# EAGLE design Schematics (EAGLE 9.0.0)
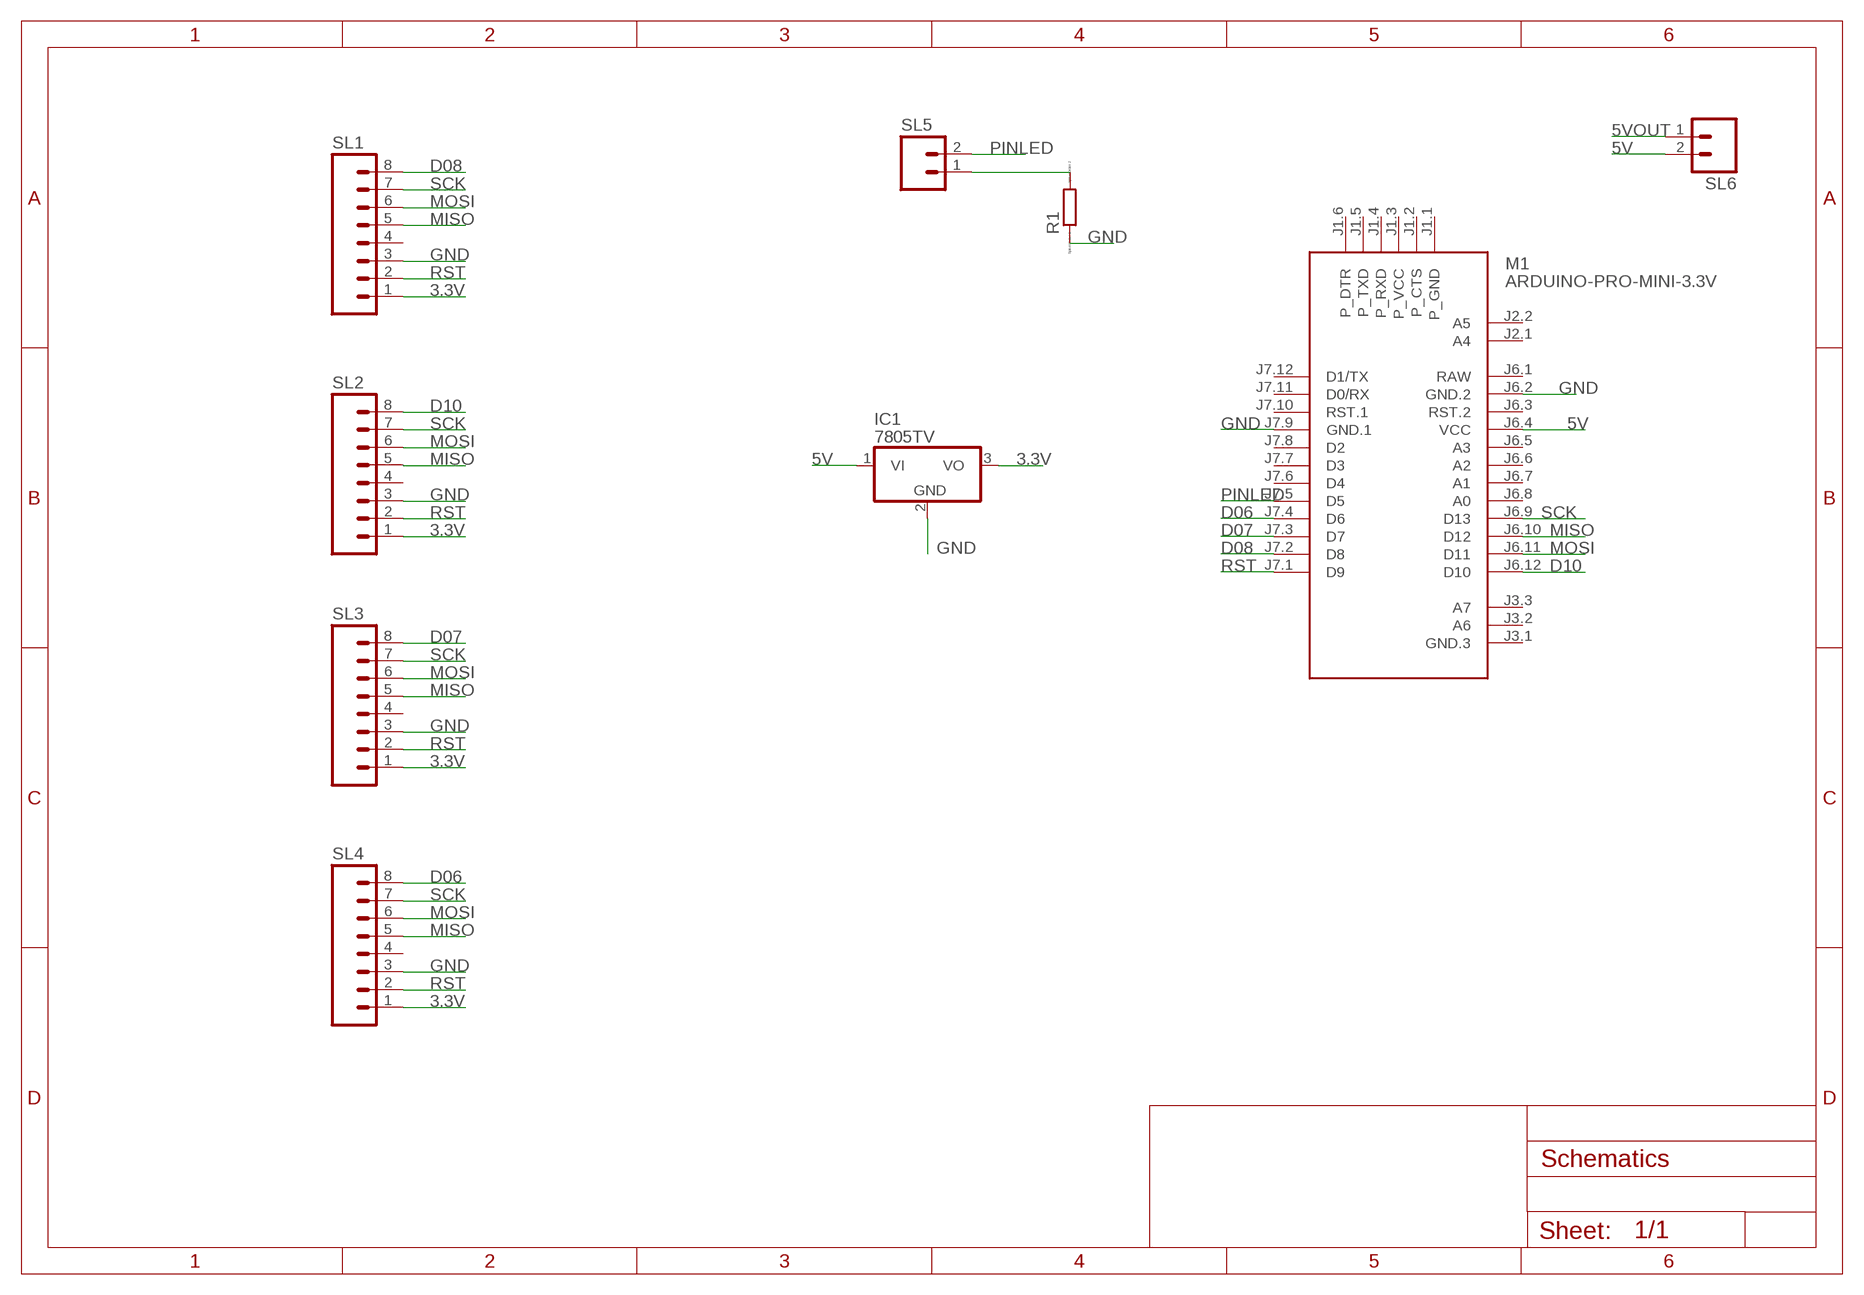
[diagram p0: schematic, sheet 1]

## Parts
IC1  7805TV  [TO220V]
M1  ARDUINO-PRO-MINI-3.3V  [ARDUINO-PRO-MINI]
R1  R0204/7  [0204/7]
SL1  M08  [08P]
SL2  M08  [08P]
SL3  M08  [08P]
SL4  M08  [08P]
SL5  M02  [02P]
SL6  M02  [02P]

## Nets
3.3V: IC1.3(VO) SL1.1 SL2.1 SL3.1 SL4.1
5V: IC1.1(VI) M1.J6.4(VCC) SL6.2
5VOUT: SL6.1
D06: M1.J7.4(D6) SL4.8
D07: M1.J7.3(D7) SL3.8
D08: M1.J7.2(D8) SL1.8
D10: M1.J6.12(D10) SL2.8
GND: IC1.2(GND) M1.J6.2(GND.2) M1.J7.9(GND.1) R1.1 SL1.3 SL2.3 SL3.3 SL4.3
MISO: M1.J6.10(D12) SL1.5 SL2.5 SL3.5 SL4.5
MOSI: M1.J6.11(D11) SL1.6 SL2.6 SL3.6 SL4.6
N$1: R1.2 SL5.1
PINLED: M1.J7.5(D5) SL5.2
RST: M1.J7.1(D9) SL1.2 SL2.2 SL3.2 SL4.2
SCK: M1.J6.9(D13) SL1.7 SL2.7 SL3.7 SL4.7
Unconnected: M1.J1.1(P_GND) M1.J1.2(P_CTS) M1.J1.3(P_VCC) M1.J1.4(P_RXD) M1.J1.5(P_TXD) M1.J1.6(P_DTR) M1.J2.1(A4) M1.J2.2(A5) M1.J3.1(GND.3) M1.J3.2(A6) M1.J3.3(A7) M1.J6.3(RST.2) M1.J6.5(A3) M1.J6.6(A2) M1.J6.7(A1) M1.J6.8(A0) M1.J7.6(D4) M1.J7.7(D3) M1.J7.8(D2) M1.J7.10(RST.1) M1.J7.11(D0/RX) M1.J7.12(D1/TX) SL1.4 SL2.4 SL3.4 SL4.4

## Power pins joined to a net without a drawn wire
RAW: M1.J6.1(RAW)

## Library data of the parts
IC1 = linear:78*: Positive VOLTAGE REGULATOR Source: http://cache.national.com/ds/LM/LM78L05.pdf http://www.fairchildsemi.com/ds/LM/LM7805.pdf
M1 = diy-modules:ARDUINO-PRO-MINI-*: Arduino Pro Mini and compatible devices More details available here: https://www.arduino.cc/en/Main/ArduinoBoardProMini Click here to find device on ebay.com <http://www.ebay.com/sch/arduino+pro+mini>
R1 = eagle-ltspice:R: RESISTOR, European symbol; SPICEMODEL: NONE; SPICEPREFIX: R
SL1-SL4 = con-amp-quick:M08: AMP QUICK CONNECTOR; OC_FARNELL: unknown; OC_NEWARK: unknown
SL5 SL6 = con-amp-quick:M02: AMP QUICK CONNECTOR; OC_FARNELL: unknown; OC_NEWARK: unknown

## Board
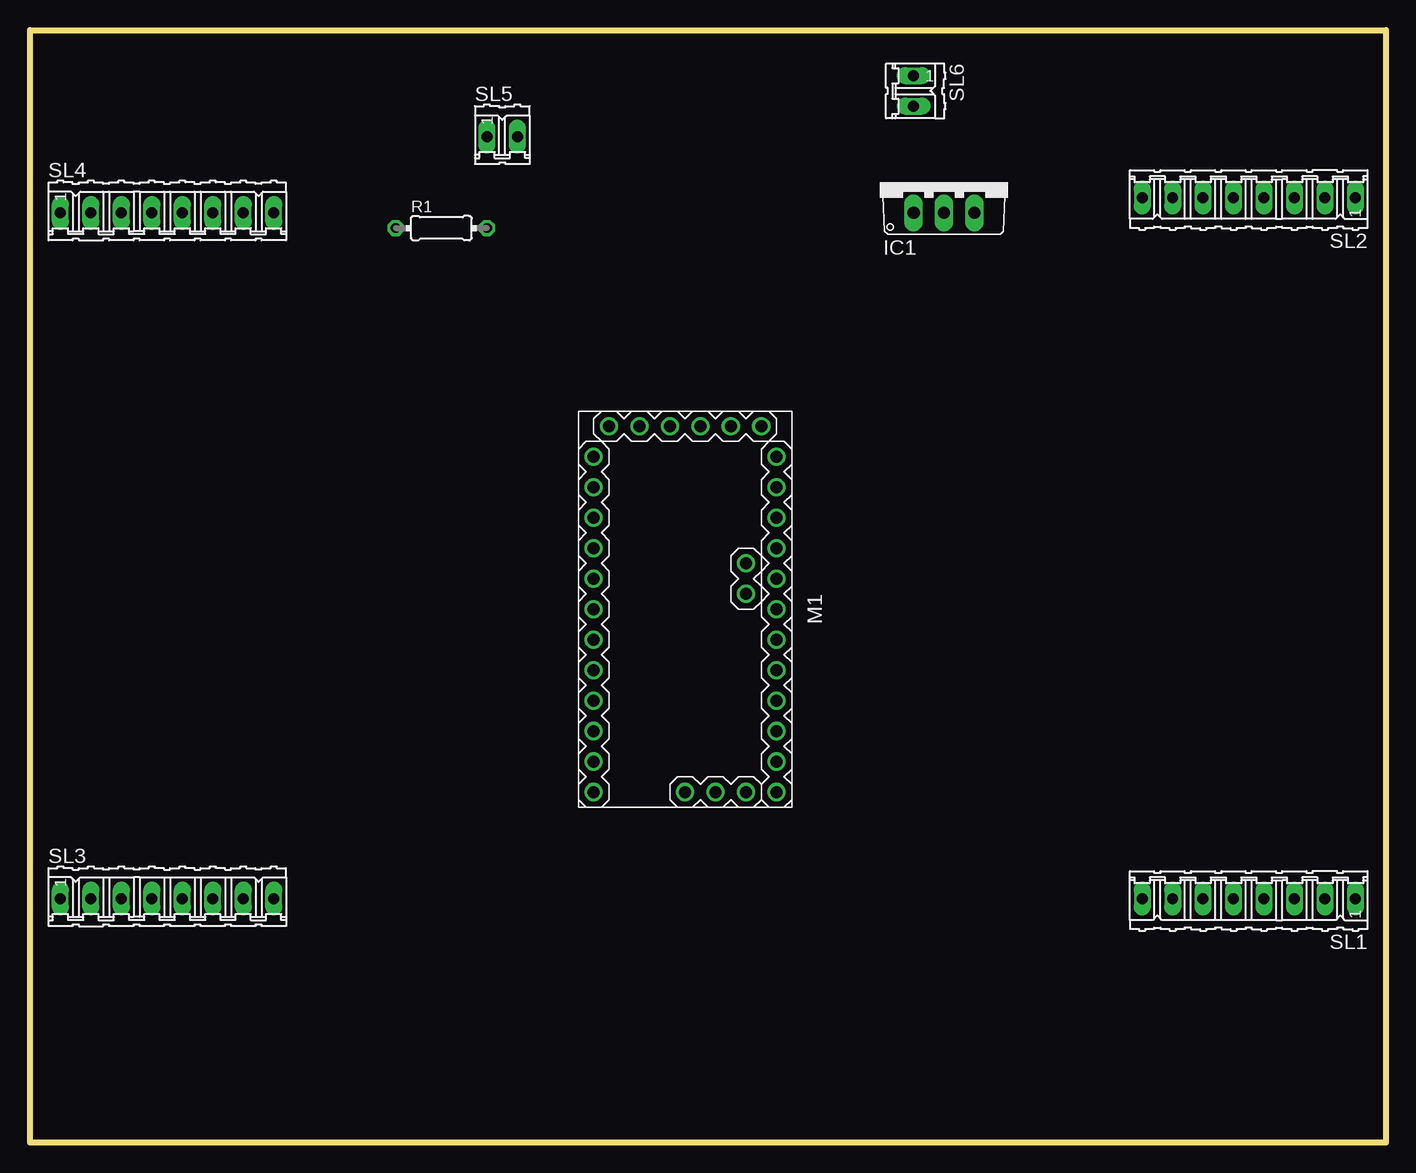
[diagram p1: board, top side]
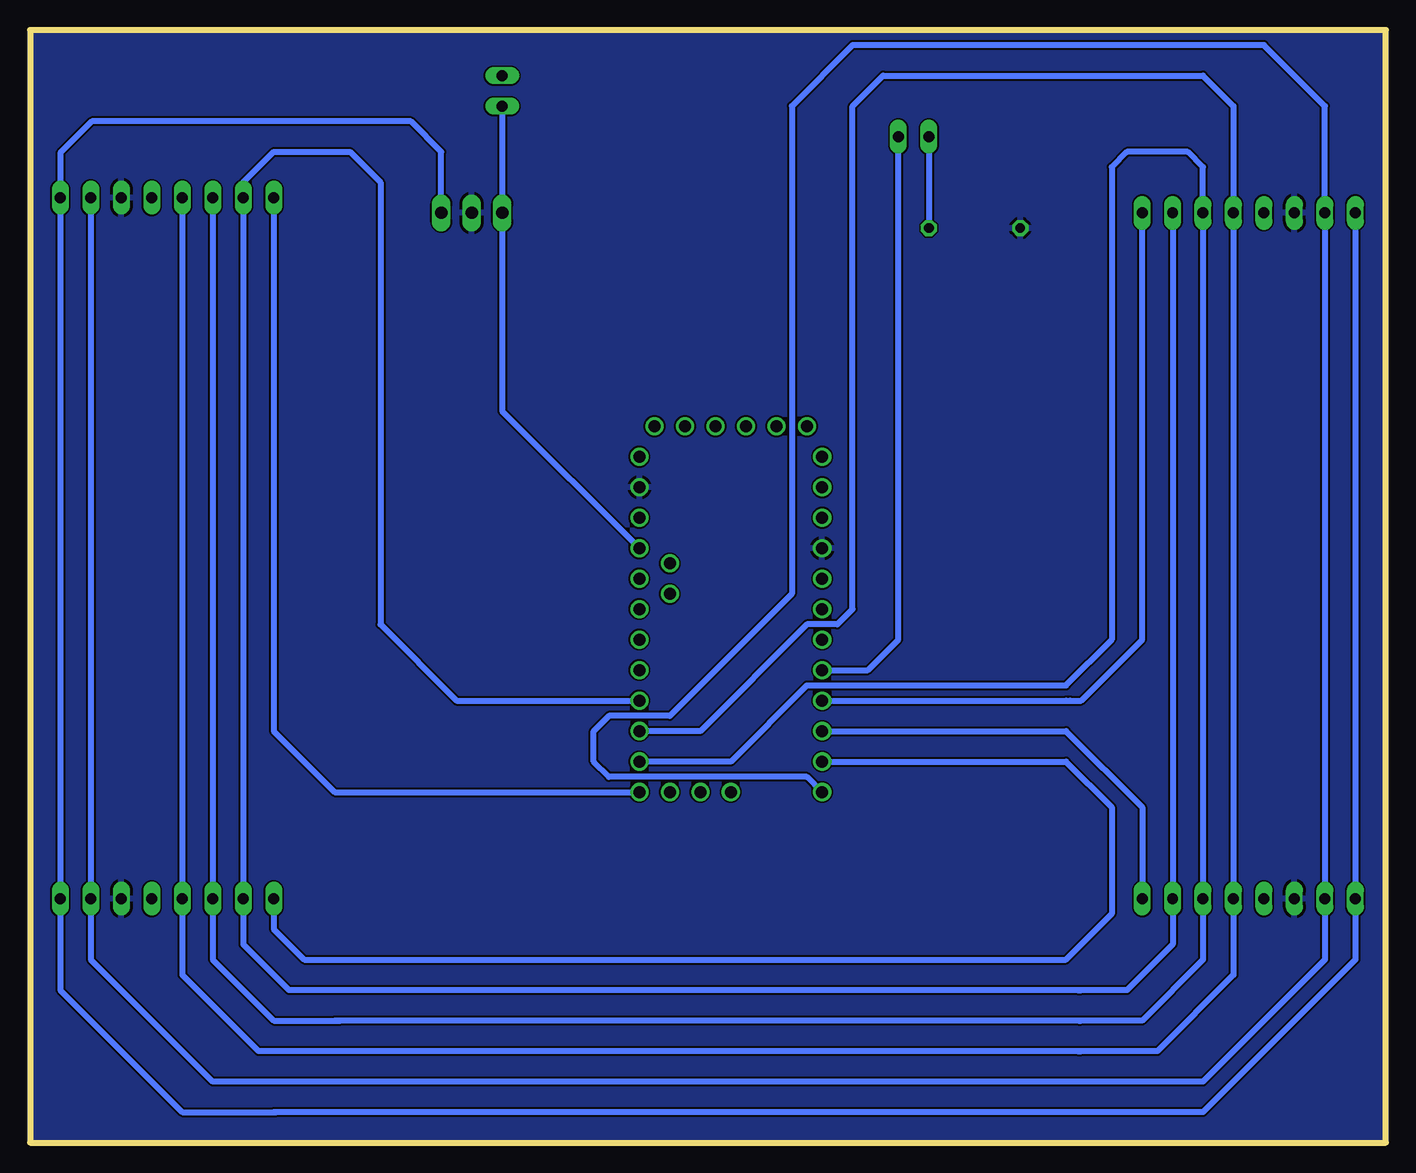
[diagram p2: board, bottom side, seen from below]

Size 113.03 x 92.71 mm. Coordinates in mm from the lower left corner, seen from the top.
Outline: 0,0 0,92.71 113.03,92.71 113.03,0 0,0
Copper layers (1*16): Top 0.035mm / dielectric 1.5mm / Bottom 0.035mm
Design rules "default *": minimum track width 6mil, minimum drill 0.35mm, track to track 6mil, track to pad 6mil, pad to pad 6mil, via to via 6mil, smd to smd 6mil, copper to edge 0mil, drill to drill 6mil, minimum pad ring 10mil, minimum via ring 8mil, stop-mask expansion 4mil, vias tented up to drill 0mil, thermal gap 10mil

### Footprints (pad centres in the part's own frame; a part is rotated, then mirrored left to right if it is on the bottom)
TO220V = drill 1.016 long: 1 -2.54,-2.54; 2 0,-2.54; 3 2.54,-2.54
ARDUINO-PRO-MINI = drill 1: J1.1 -15.24,6.35; J1.2 -15.24,3.81; J1.3 -15.24,1.27; J1.4 -15.24,-1.27; J1.5 -15.24,-3.81; J1.6 -15.24,-6.35; J2.1 -1.27,5.08; J2.2 -3.81,5.08; J3.1 15.24,0; J3.2 15.24,2.54; J3.3 15.24,5.08; J6.1 -12.7,7.62; J6.2 -10.16,7.62; J6.3 -7.62,7.62; J6.4 -5.08,7.62; J6.5 -2.54,7.62; J6.6 0,7.62; J6.7 2.54,7.62; J6.8 5.08,7.62; J6.9 7.62,7.62; J6.10 10.16,7.62; J6.11 12.7,7.62; J6.12 15.24,7.62; J7.1 15.24,-7.62; J7.2 12.7,-7.62; J7.3 10.16,-7.62; J7.4 7.62,-7.62; J7.5 5.08,-7.62; J7.6 2.54,-7.62; J7.7 0,-7.62; J7.8 -2.54,-7.62; J7.9 -5.08,-7.62; J7.10 -7.62,-7.62; J7.11 -10.16,-7.62; J7.12 -12.7,-7.62
0204/7 = drill 0.813 octagon: 1 -3.81,0; 2 3.81,0
08P = drill 0.914 long: 1 -8.89,0; 2 -6.35,0; 3 -3.81,0; 4 -1.27,0; 5 1.27,0; 6 3.81,0; 7 6.35,0; 8 8.89,0
02P = drill 0.914 long: 1 -1.27,0; 2 1.27,0

### Placement (x,y rotation side)
IC1  76.2,80.01 0 top
M1  54.61,44.45 270 top
R1  34.29,76.2 0 top
SL1  101.6,20.32 180 top
SL2  101.6,78.74 180 top
SL3  11.43,20.32 0 top
SL4  11.43,77.47 0 top
SL5  39.37,83.82 0 top
SL6  73.66,87.63 270 top

### Tracks (layer width: path | path; a pad name or v marks a point on that pad's centre or on a via)
3.3V
  Bottom 0.508: SL4.1 SL3.1 2.54,15.24 15.24,2.54 92.48,2.54 | IC1.3 78.74,82.55 81.28,85.09 107.87,85.09 110.49,82.47 SL2.1 SL1.1 110.49,12.7 100.33,2.54 92.48,2.54 | 92.48,2.54 92.71,2.54
5V
  Bottom 0.508: SL6.2 IC1.1 73.66,60.96 M1.J6.4
D06
  Bottom 0.508: M1.J7.4 26.67,36.83 | 26.67,36.83 26.34,36.83 | 26.67,36.83 25.4,36.83 20.32,41.91 SL4.8
D07
  Bottom 0.508: M1.J7.3 26.67,34.29 20.32,27.94 SL3.8
D08
  Bottom 0.508: M1.J7.2 26.67,31.75 22.86,27.94 22.86,19.05 26.67,15.24 90.17,15.24 92.71,17.78 SL1.8
D10
  Bottom 0.508: SL2.8 92.71,34.29 87.63,29.21 M1.J6.12
GND
  pour Bottom: 0,92.71 0,0 113.03,0 113.03,92.71
MISO
  Bottom 0.508: SL2.5 SL1.5 100.33,13.97 93.98,7.62 25.73,7.62 | M1.J6.10 57.15,34.29 48.26,43.18 45.72,43.18 44.45,44.45 44.45,86.36 41.91,88.9 15.24,88.9 12.7,86.36 SL4.5 SL3.5 12.7,13.97 19.05,7.62 25.73,7.62 | 25.73,7.62 25.4,7.62
MOSI
  Bottom 0.508: SL2.6 SL1.6 97.79,15.24 92.71,10.16 87.14,10.16 | M1.J6.11 54.61,31.75 48.26,38.1 26.67,38.1 22.86,41.91 22.86,81.28 21.59,82.55 16.51,82.55 15.24,81.28 SL4.6 SL3.6 15.24,15.24 20.32,10.16 25.65,10.16 | 25.65,10.16 87.14,10.16 | 25.65,10.16 25.4,10.16 | 87.14,10.16 87.63,10.16
N$1
  Bottom 0.508: SL5.1 R1.2
PINLED
  Bottom 0.508: M1.J7.5 43.18,39.37 40.64,41.91 SL5.2
RST
  Bottom 0.508: SL2.2 SL1.2 107.95,15.24 97.79,5.08 15.24,5.08 5.08,15.24 SL3.2 SL4.2 5.08,86.36 10.16,91.44 44.45,91.44 49.53,86.36 49.53,45.72 59.69,35.56 64.77,35.56 66.04,34.29 66.04,31.75 64.77,30.48 48.26,30.48 M1.J7.1
SCK
  Bottom 0.508: SL4.7 SL3.7 17.78,16.51 21.59,12.7 25.73,12.7 | M1.J6.9 77.47,36.83 83.82,43.18 83.82,80.01 86.36,82.55 92.71,82.55 95.25,80.01 SL2.7 SL1.7 95.25,16.51 91.44,12.7 25.73,12.7 | 25.73,12.7 25.4,12.7